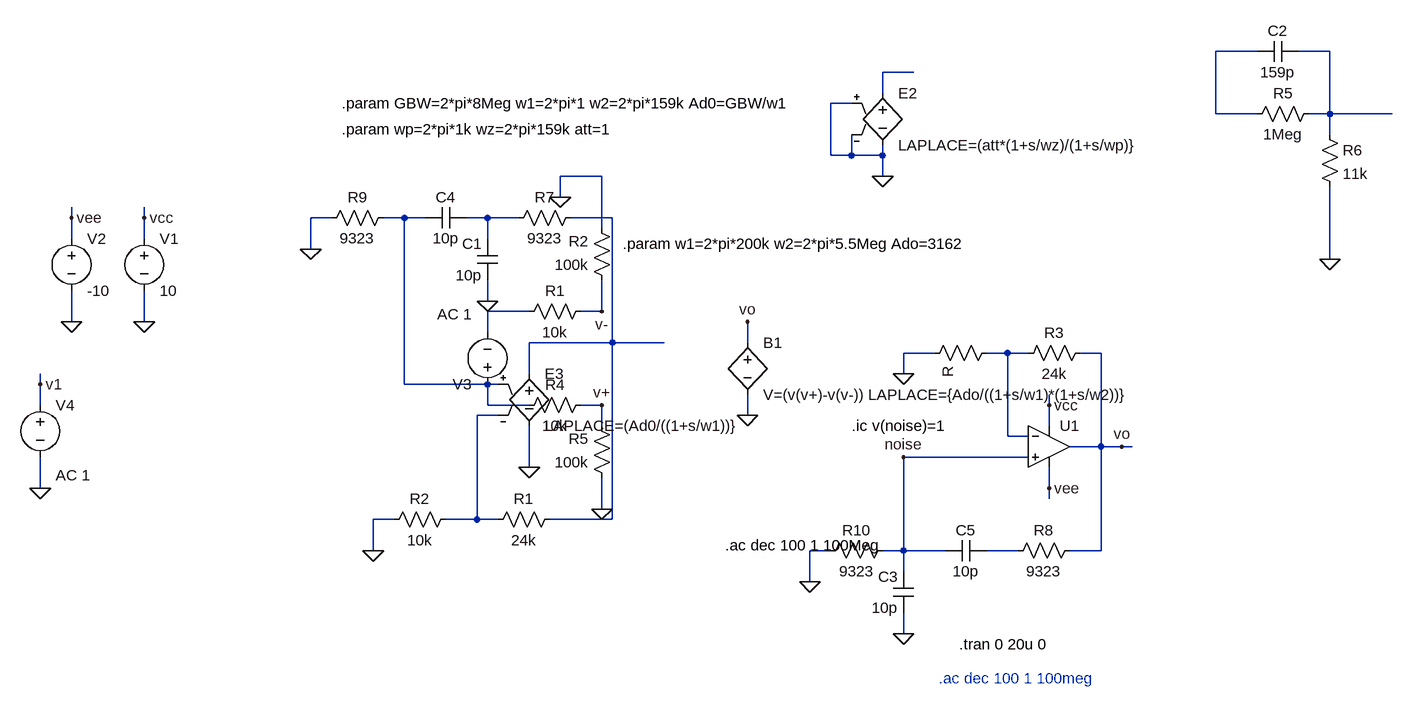
[diagram p0: schematic Draft1.asc]
Draft1.asc, the LTspice schematic file:
Version 4
<<<<<<< Updated upstream
SHEET 1 2020 948
WIRE 1472 -240 1408 -240
WIRE 1584 -240 1536 -240
WIRE 944 -208 896 -208
WIRE 896 -176 896 -208
WIRE 848 -160 816 -160
WIRE 1408 -144 1408 -240
WIRE 1472 -144 1408 -144
WIRE 1584 -144 1584 -240
WIRE 1584 -144 1552 -144
WIRE 1680 -144 1584 -144
WIRE 1584 -112 1584 -144
WIRE 816 -80 816 -160
WIRE 848 -80 848 -112
WIRE 848 -80 816 -80
WIRE 896 -80 896 -96
WIRE 896 -80 848 -80
WIRE 896 -48 896 -80
WIRE -352 16 -352 0
WIRE -240 16 -240 0
WIRE 48 16 16 16
WIRE 160 16 128 16
WIRE 192 16 160 16
WIRE 288 16 256 16
WIRE 336 16 288 16
WIRE 480 16 416 16
WIRE -352 48 -352 16
WIRE -240 48 -240 16
WIRE 288 48 288 16
WIRE 16 64 16 16
WIRE 1584 80 1584 -32
WIRE 288 144 288 112
WIRE -352 176 -352 128
WIRE -240 176 -240 128
WIRE 480 208 480 16
WIRE 480 208 352 208
WIRE 560 208 480 208
WIRE 976 224 928 224
WIRE 1088 224 1056 224
WIRE 1120 224 1088 224
WIRE 1232 224 1200 224
WIRE 352 256 352 208
WIRE 928 256 928 224
WIRE -400 272 -400 256
WIRE 160 272 160 16
WIRE 304 272 160 272
WIRE -400 304 -400 272
WIRE 1152 304 1152 288
WIRE 304 320 272 320
WIRE 1152 336 1152 304
WIRE 1088 352 1088 224
WIRE 1120 352 1088 352
WIRE 1232 368 1232 224
WIRE 1232 368 1184 368
WIRE 1264 368 1232 368
WIRE 1280 368 1264 368
WIRE 1120 384 928 384
WIRE 352 400 352 336
WIRE -400 432 -400 384
WIRE 1152 432 1152 400
WIRE 1152 448 1152 432
WIRE 144 480 112 480
WIRE 272 480 272 320
WIRE 272 480 224 480
WIRE 304 480 272 480
WIRE 480 480 480 208
WIRE 480 480 384 480
WIRE 112 528 112 480
WIRE 816 528 784 528
WIRE 928 528 928 384
WIRE 928 528 896 528
WIRE 992 528 928 528
WIRE 1104 528 1056 528
WIRE 1232 528 1232 368
WIRE 1232 528 1184 528
WIRE 928 560 928 528
WIRE 784 576 784 528
WIRE 928 656 928 624
FLAG -240 176 0
FLAG -240 16 vcc
FLAG -352 176 0
FLAG -352 16 vee
FLAG -400 432 0
FLAG -400 272 v1
FLAG 1584 80 0
FLAG 896 -48 0
FLAG 352 400 0
FLAG 112 528 0
FLAG 1152 432 vee
FLAG 1152 304 vcc
FLAG 928 256 0
FLAG 16 64 0
FLAG 288 144 0
FLAG 784 576 0
FLAG 928 656 0
FLAG 928 384 noise
FLAG 1264 368 vo
SYMBOL voltage -240 32 R0
WINDOW 123 0 0 Left 0
WINDOW 39 0 0 Left 0
SYMATTR InstName V1
SYMATTR Value 10
SYMBOL voltage -352 32 R0
WINDOW 123 0 0 Left 0
WINDOW 39 0 0 Left 0
SYMATTR InstName V2
SYMATTR Value -10
SYMBOL voltage -400 288 R0
WINDOW 123 24 124 Left 2
WINDOW 39 0 0 Left 0
SYMATTR Value2 AC 1
SYMATTR InstName V4
SYMATTR Value ""
SYMBOL res 1456 -128 R270
WINDOW 0 32 56 VTop 2
WINDOW 3 0 56 VBottom 2
SYMATTR InstName R5
SYMATTR Value 1Meg
SYMBOL res 1568 -128 R0
SYMATTR InstName R6
SYMATTR Value 11k
SYMBOL cap 1536 -256 R90
WINDOW 0 0 32 VBottom 2
WINDOW 3 32 32 VTop 2
SYMATTR InstName C2
SYMATTR Value 159p
SYMBOL e 896 -192 R0
SYMATTR InstName E2
SYMATTR Value LAPLACE=(att*(1+s/wz)/(1+s/wp)}
SYMBOL e 352 240 R0
SYMATTR InstName E3
SYMATTR Value LAPLACE=(Ad0/((1+s/w1))}
SYMBOL res 400 464 R90
WINDOW 0 0 56 VBottom 2
WINDOW 3 32 56 VTop 2
SYMATTR InstName R1
SYMATTR Value 24k
SYMBOL res 240 464 R90
WINDOW 0 0 56 VBottom 2
WINDOW 3 32 56 VTop 2
SYMATTR InstName R2
SYMATTR Value 10k
SYMBOL res 1216 208 R90
WINDOW 0 0 56 VBottom 2
WINDOW 3 32 56 VTop 2
SYMATTR InstName R3
SYMATTR Value 24k
SYMBOL res 1072 208 R90
=======
SHEET 1 1680 768
WIRE 464 -48 400 -48
WIRE 400 -16 400 -48
WIRE 464 32 464 -48
WIRE 352 160 288 160
WIRE 464 160 464 112
WIRE 464 160 432 160
WIRE 288 192 288 160
WIRE 688 208 688 176
WIRE 288 304 288 272
WIRE 352 304 288 304
WIRE 464 304 432 304
WIRE 688 320 688 288
WIRE 464 336 464 304
WIRE 464 464 464 416
FLAG 688 176 vo
FLAG 688 320 0
FLAG 464 464 0
FLAG 400 -16 0
FLAG 464 160 v-
FLAG 464 304 v+
SYMBOL voltage 288 288 R180
WINDOW 123 24 124 Left 2
WINDOW 39 0 0 Left 0
SYMATTR Value2 AC 1
SYMATTR InstName V3
SYMATTR Value ""
SYMBOL bv 688 192 R0
SYMATTR InstName B1
SYMATTR Value V=(v(v+)-v(v-)) LAPLACE={Ado/((1+s/w1)*(1+s/w2))}
SYMBOL res 448 144 R90
WINDOW 0 0 56 VBottom 2
WINDOW 3 32 56 VTop 2
SYMATTR InstName R1
SYMATTR Value 10k
SYMBOL res 480 128 R180
WINDOW 0 36 76 Left 2
WINDOW 3 36 40 Left 2
SYMATTR InstName R2
SYMATTR Value 100k
SYMBOL res 480 432 R180
WINDOW 0 36 76 Left 2
WINDOW 3 36 40 Left 2
SYMATTR InstName R5
SYMATTR Value 100k
SYMBOL res 448 288 R90
>>>>>>> Stashed changes
WINDOW 0 0 56 VBottom 2
WINDOW 3 32 56 VTop 2
SYMATTR InstName R4
SYMATTR Value 10k
<<<<<<< Updated upstream
SYMBOL res 432 0 R90
WINDOW 0 0 56 VBottom 2
WINDOW 3 32 56 VTop 2
SYMATTR InstName R7
SYMATTR Value 9323
SYMBOL cap 304 112 R180
WINDOW 0 24 56 Left 2
WINDOW 3 24 8 Left 2
SYMATTR InstName C1
SYMATTR Value 10p
SYMBOL res 144 0 R90
WINDOW 0 0 56 VBottom 2
WINDOW 3 32 56 VTop 2
SYMATTR InstName R9
SYMATTR Value 9323
SYMBOL cap 192 32 R270
WINDOW 0 32 32 VTop 2
WINDOW 3 0 32 VBottom 2
SYMATTR InstName C4
SYMATTR Value 10p
SYMBOL res 1200 512 R90
WINDOW 0 0 56 VBottom 2
WINDOW 3 32 56 VTop 2
SYMATTR InstName R8
SYMATTR Value 9323
SYMBOL cap 944 624 R180
WINDOW 0 24 56 Left 2
WINDOW 3 24 8 Left 2
SYMATTR InstName C3
SYMATTR Value 10p
SYMBOL res 912 512 R90
WINDOW 0 0 56 VBottom 2
WINDOW 3 32 56 VTop 2
SYMATTR InstName R10
SYMATTR Value 9323
SYMBOL cap 992 544 R270
WINDOW 0 32 32 VTop 2
WINDOW 3 0 32 VBottom 2
SYMATTR InstName C5
SYMATTR Value 10p
SYMBOL OpAmps\\UniversalOpamp2 1152 368 R0
SYMATTR InstName U1
SYMATTR Value2 Avol=1Meg GBW=8Meg Slew=10Meg
TEXT 64 -160 Left 2 !.param GBW=2*pi*8Meg w1=2*pi*1 w2=2*pi*159k Ad0=GBW/w1
TEXT 64 -120 Left 2 !.param wp=2*pi*1k wz=2*pi*159k att=1
TEXT 848 336 Left 2 !.ic v(noise)=1
TEXT 1014 672 Left 2 !.tran 0 20u 0
TEXT 982 724 Left 2 ;.ac dec 100 1 100meg
=======
TEXT 496 56 Left 2 !.param w1=2*pi*200k w2=2*pi*5.5Meg Ado=3162
TEXT 654 520 Left 2 !.ac dec 100 1 100Meg
>>>>>>> Stashed changes

The netlist it stands for:
* Draft1.asc
V1 vcc 0 10
V2 vee 0 -10
V4 v1 0 AC 1
R5 N001 N002 1Meg
R6 N002 0 11k
C2 N002 N001 159p
E2 N003 0 0 0 LAPLACE=(att*(1+s/wz)/(1+s/wp)}
E3 N006 0 N004 N008 LAPLACE=(Ad0/((1+s/w1))}
R1 N006 N008 24k
R2 N008 0 10k
R3 vo N007 24k
R§? N007 0 R
V3 N004 N010 AC 1
B1 vo 0 V=(v(v+)-v(v-)) LAPLACE={Ado/((1+s/w1)*(1+s/w2))}
R1 v- N010 10k
R2 v- 0 100k
R5 0 v+ 100k
R4 v+ N004 10k
R7 N006 N005 9323
C1 0 N005 10p
R9 N004 0 9323
C4 N004 N005 10p
R8 vo N009 9323
C3 0 noise 10p
R10 noise 0 9323
C5 noise N009 10p
XU1 noise N007 vcc vee vo level.2 Avol=1Meg GBW=8Meg Slew=10Meg ilimit=25m rail=0 Vos=0 phimargin=45 en=0 enk=0 in=0 ink=0 Rin=500Meg  ; pins IN+ IN- V+ V- OUT
.param GBW=2*pi*8Meg w1=2*pi*1 w2=2*pi*159k Ad0=GBW/w1
.param wp=2*pi*1k wz=2*pi*159k att=1
.ic v(noise)=1
.tran 0 20u 0
* .ac dec 100 1 100meg
.param w1=2*pi*200k w2=2*pi*5.5Meg Ado=3162
.ac dec 100 1 100Meg
.lib UniversalOpamps2.sub
.backanno
.end